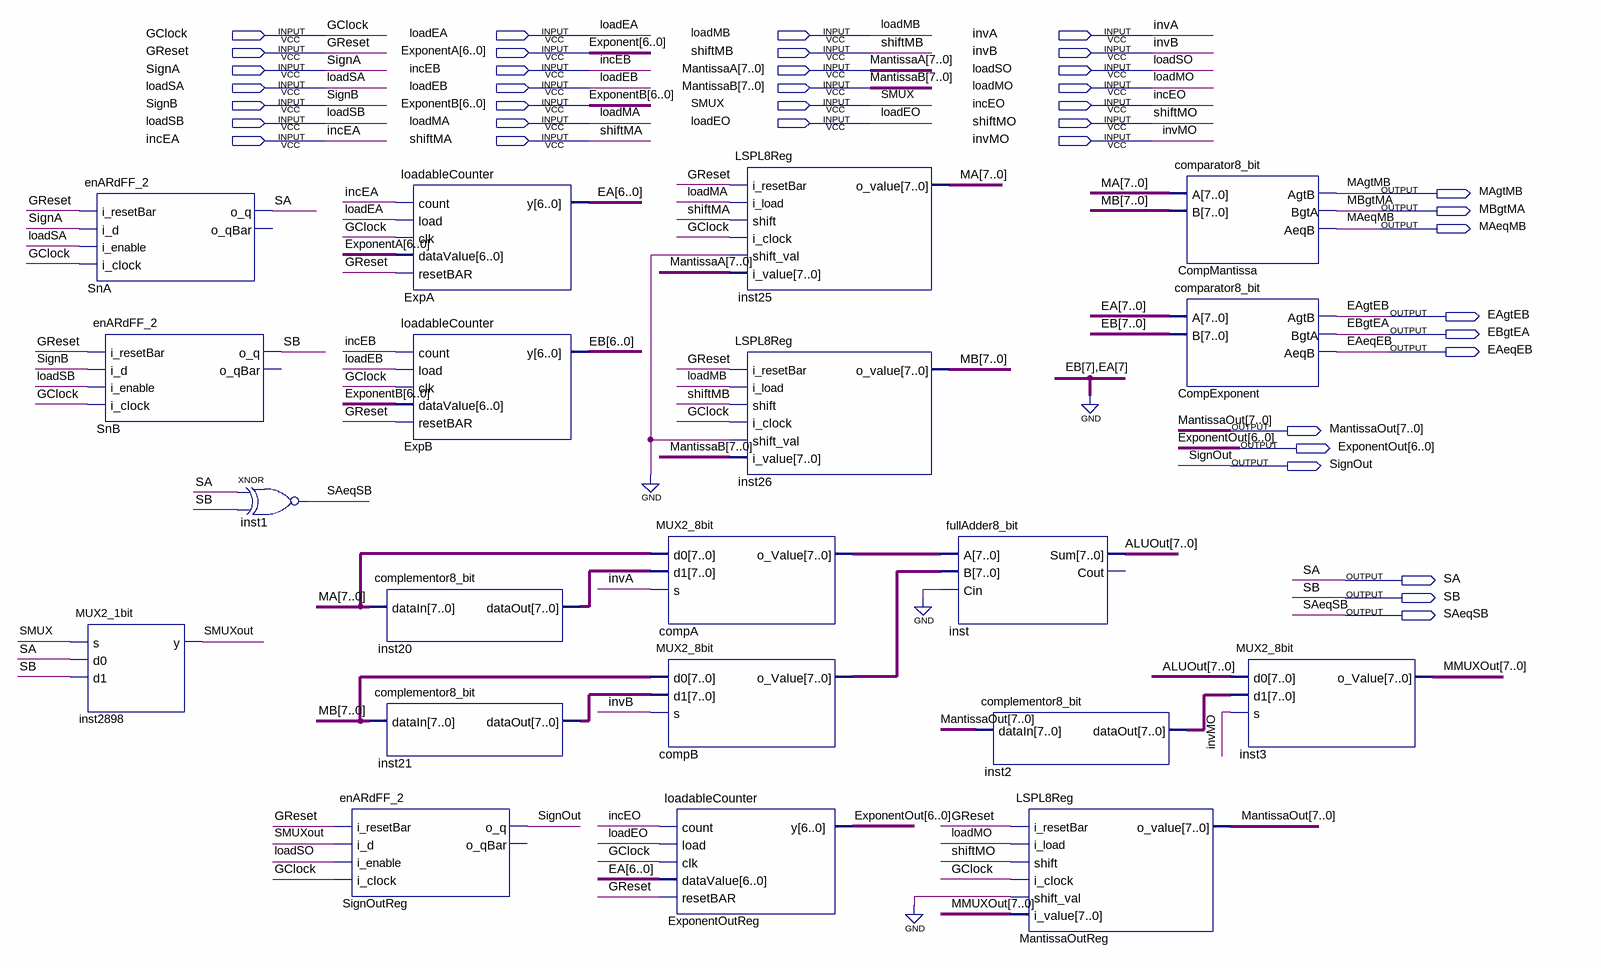
[diagram p0: schematic sheet]
// Quartus schematic DataPath.bdf as structural Verilog: 20 symbols, 39 pins
module DataPath (
  input  GClock,
  input  loadEA,
  input  loadMB,
  input  invA,
  input  GReset,
  input  [6:0] ExponentA,
  input  shiftMB,
  input  invB,
  input  SignA,
  input  incEB,
  input  [7:0] MantissaA,
  input  loadSO,
  input  loadSA,
  input  loadEB,
  input  [7:0] MantissaB,
  input  loadMO,
  input  SignB,
  input  [6:0] ExponentB,
  input  SMUX,
  input  incEO,
  input  loadSB,
  input  loadMA,
  input  loadEO,
  input  shiftMO,
  input  incEA,
  input  shiftMA,
  input  invMO,
  output MAgtMB,
  output MBgtMA,
  output MAeqMB,
  output EAgtEB,
  output EBgtEA,
  output EAeqEB,
  output [7:0] MantissaOut,
  output [6:0] ExponentOut,
  output SignOut,
  output SA,
  output SB,
  output SAeqSB
);

  wire SMUXout;
  wire [6:0] EA, EB;
  wire [7:0] ALUOut, compA_o_value, compB_o_value, inst2_dataout, inst20_dataout, inst21_dataout, MA, MB,
       MMUXOut;

  enARdFF_2 SnA (.i_resetBar(GReset), .i_d(SignA), .i_enable(loadSA), .i_clock(GClock), .o_q(SA));  // open: o_qBar
  enARdFF_2 SnB (.i_resetBar(GReset), .i_d(SignB), .i_enable(loadSB), .i_clock(GClock), .o_q(SB));  // open: o_qBar
  MUX2_1bit inst2898 (.s(SMUX), .d0(SA), .d1(SB), .y(SMUXout));
  xnor inst1 (SAeqSB, SA, SB);
  loadableCounter ExpA (.count(incEA), .load(loadEA), .clk(GClock), .dataValue(ExponentA), .resetBAR(GReset), .y(EA));
  loadableCounter ExpB (.count(incEB), .load(loadEB), .clk(GClock), .dataValue(ExponentB), .resetBAR(GReset), .y(EB));
  complementor8_bit inst20 (.dataIn(MA), .dataOut(inst20_dataout));
  complementor8_bit inst21 (.dataIn(MB), .dataOut(inst21_dataout));
  enARdFF_2 SignOutReg (
    .i_resetBar(GReset), .i_d(SMUXout), .i_enable(loadSO), .i_clock(GClock), .o_q(SignOut));  // open: o_qBar
  MUX2_8bit compA (.d0(MA), .d1(inst20_dataout), .s(invA), .o_Value(compA_o_value));
  MUX2_8bit compB (.d0(MB), .d1(inst21_dataout), .s(invB), .o_Value(compB_o_value));
  loadableCounter ExponentOutReg (
    .count(incEO), .load(loadEO), .clk(GClock), .dataValue(EA), .resetBAR(GReset), .y(ExponentOut));
  LSPL8Reg inst25 (
    .i_resetBar(GReset), .i_load(loadMA), .shift(shiftMA), .i_clock(GClock), .shift_val(1'b0),
    .i_value(MantissaA), .o_value(MA));
  LSPL8Reg inst26 (
    .i_resetBar(GReset), .i_load(loadMB), .shift(shiftMB), .i_clock(GClock), .shift_val(1'b0),
    .i_value(MantissaB), .o_value(MB));
  fullAdder8_bit inst (.A(compA_o_value), .B(compB_o_value), .Cin(1'b0), .Sum(ALUOut));  // open: Cout
  complementor8_bit inst2 (.dataIn(MantissaOut), .dataOut(inst2_dataout));
  LSPL8Reg MantissaOutReg (
    .i_resetBar(GReset), .i_load(loadMO), .shift(shiftMO), .i_clock(GClock), .shift_val(1'b0),
    .i_value(MMUXOut), .o_value(MantissaOut));
  comparator8_bit CompMantissa (.A(MA), .B(MB), .AgtB(MAgtMB), .BgtA(MBgtMA), .AeqB(MAeqMB));
  comparator8_bit CompExponent (.A({1'b0, EA}), .B({1'b0, EB}), .AgtB(EAgtEB), .BgtA(EBgtEA), .AeqB(EAeqEB));
  MUX2_8bit inst3 (.d0(ALUOut), .d1(inst2_dataout), .s(invMO), .o_Value(MMUXOut));

  // Other names for the same wires on the sheet: Exponent[6:0] = ExponentA
endmodule
